# Altium schematic sheet PCB_BLU3.SchDoc
size A4
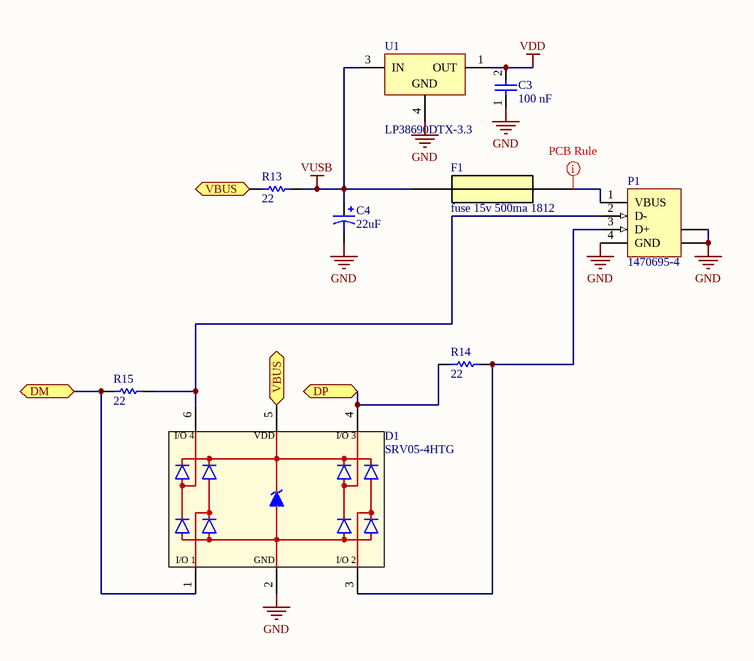
[diagram p0: PCB_BLU3.SchDoc]

## Parts
C3  100 nF  [WCAP-CSGP 1206, H=0.8mm]
C4  22uF  [6032]
D1  SRV05-4HTG  [SOT23-6L]
F1  fuse 15v 500ma 1812  [Fuse-LAND]
P1  1470695-4  [1470695A]
R13  22  [RES0402R]
R14  22  [RES0402R]
R15  22  [RES0402R]
U1  LP38690DTX-3.3  [TD03B_N]

## Ports
DM (bidir), DP (bidir), VBUS (bidir)

## Nets
GND: C3.1 C4.2 D1.2(GND) P1.4(GND) P1.5(SHLD) P1.6(SHLD) U1.4(GND)
VDD: C3.2 U1.1(OUT)
VUSB: C4.1 F1.1 R13.1 U1.3(IN)
DM: D1.1(I/O_1) R15.2 ; port DM
DP: D1.4(I/O_3) R14.2 ; port DP
VBUS: D1.5(VDD) R13.2 ; port VBUS
NetD1_3: D1.3(I/O_2) P1.3(D+) R14.1
NetD1_6: D1.6(I/O_4) P1.2(D-) R15.1
NetF1_2: F1.2 P1.1(VBUS)

## Layout directives
rule Width Constraint [Pref Width = 0.7mm    Min Width = 0.254mm    Max Width = 0.7mm]: NetF1_2

## Library data of the parts
C3 = WCAP-CSGP 1206, 885012208009: WCAP-CSGP MLCC, X7R, 1206, 100000 pF,10Vdc; Manufacturer: Wurth Elektronik; E-mail: libraries@we-online.com; ComponentLink1Description: Manufacturer; ComponentLink1URL: http://www.we-online.com; ComponentLink2Description: Datasheet; ComponentLink2URL: http://katalog.we-online.de/pbs/datasheet/885012208009.pdf; Created by: Karrer Zheng; Created Date: 3/9/2015; Capacitance: 100 nF; partNo: 885012208009
C4 = CWR11DH226M: Tantamount Military, Surface Mount MIL-PRF-55365/8 Qualified Solid Tantalum Chip Capacitor: 22uF, 20% Tolerance, 6 WVDC @ +85°C, Surge = 8V; Note: See Data Sheet for full range of components; Published: 19-Mar-2004; DatasheetDocument: 20-Mar-2003; PackageReference: 6032; Publisher: Altium Limited; Code_JEITA: 6032; ComponentLink1Description: Manufacturer Link; ComponentLink1URL: http://www.vishay.com/; ComponentLink2Description: Datasheet; ComponentLink2URL: http://www.vishay.com/docs/40011/cwr11.pdf; Value: 22uF
D1 = WE-TVS, SOT23-6L, 824001: WE-TVS TVS Diode, High Speed Series, SOT23-6L, VDC = 5V; PartNo: 824001; Manufacturer: Wurth Elektronik; VDC: 5V; ComponentLink1Description: Manufacturer; ComponentLink1URL: http://www.we-online.de; Created by: BJ.Chen; Created Date: Jan 2016; ComponentLink2Description: Datasheet; ComponentLink2URL: http://katalog.we-online.de/pbs/datasheet/824001.pdf
F1 = Fuse 500ma: FUSE; Value: fuse 15v 500ma 1812
P1 = 1470695-4: USB 1.1, Right Angle, SMT, A Type, Plug, 4 Position, Black; ContactMaterial: Brass; ContactPlating: Gold (30) over Nickel (50); PCB_Layout: Complies with manufacturer's recommendation.; DrillSize: Corresponds to nominal value.; PanelGround: Without; Published: 15-Jul-2004; DatasheetDocument: 21-Jan-2003; PackageDocument: 21-Jan-2003; PackageReference: 1470695A; Publisher: Altium Limited; HousingMaterial: Thermoplastic; ComponentLink1Description: Manufacturer Link; ComponentLink1URL: http://www.tycoelectronics.com/; ComponentLink2Description: Packaging Specification; ComponentLink2URL: http://ecommas.tycoelectronics.com/commerce/DocumentDelivery/DDEController?Action=showdoc&DocId=Customer+Drawing%7F1470695%7FO%7Fpdf%7FEnglish%7FC_1470695_O.pdf
R13-R15 = Resistor1: Resistor; Value: =Value
U1 = LP38690DTX-3.3: 1A Low Dropout CMOS Linear Regulators Stable with Ceramic Output Capacitors, 3-pin TO-252; Manufacturer: National Semiconductor; PackageTopMarking: NSUZXYTT*LP38690*DT-3.3; PowerWise: Y; CompType: LDO IC; DatasheetVersion: May-2005; PackageVersion: revD, Feb-2009; PackageReference: TD03B; PackageDescription: TO252, Molded, Jedec, 6.8 x 6.10 x 2.30mm Body, 3 Lead, 2.28mm Pitch, Surface Mount; PartNumber: LP38690DTX-3.3; RoHS: N; PinCount: 3; High-Reliability: Y; Code_JEDEC: TO-252-AA; ComponentLink1Description: Manufacturer URL; ComponentLink1URL: http://www.national.com/; ComponentLink2Description: LP38690 Datasheet; ComponentLink2URL: http://www.national.com/ds/LP/LP38690.pdf; ComponentLink3Description: LP38690 Web Page; ComponentLink3URL: http://www.national.com/pf/LP/LP38690.html; ComponentLink4Description: TD03B Package Page; ComponentLink4URL: http://www.national.com/packaging/folders/td03b.html